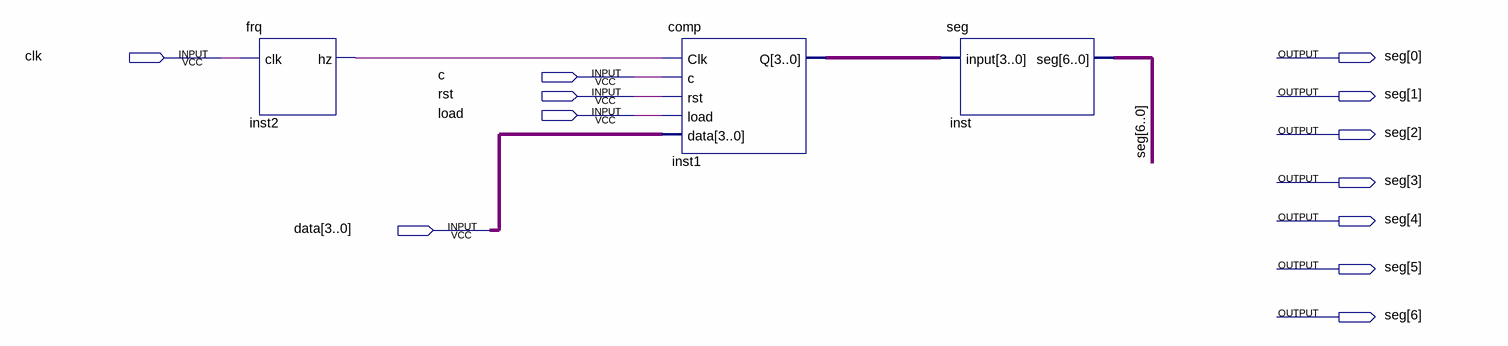
[diagram p0: schematic sheet]
// Quartus schematic s.bdf as structural Verilog: 3 symbols, 12 pins
module s (
  input  clk,
  input  c,
  input  rst,
  input  load,
  input  [3:0] data,
  output [6:0] seg
);

  wire inst2_hz;
  wire [3:0] inst1_q;

  frq inst2 (.clk(clk), .hz(inst2_hz));
  comp inst1 (.Clk(inst2_hz), .c(c), .rst(rst), .load(load), .data(data), .Q(inst1_q));
  seg inst (.\input (inst1_q), .seg(seg));
endmodule
